# EAGLE design vader (EAGLE 7.4.0)
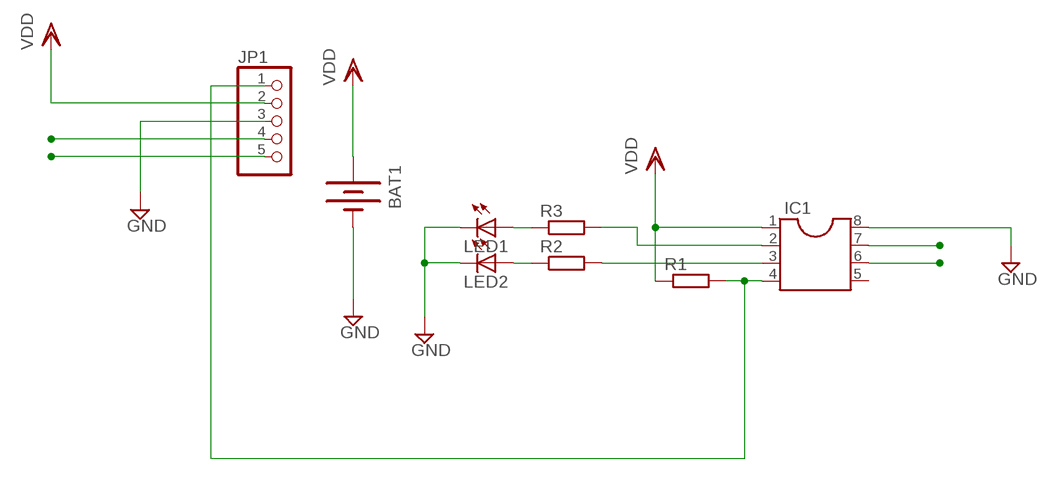
[diagram p0: schematic, sheet 1]

## Parts
BAT1  BATTERY20PTH  [BATTCOM_20MM_PTH]
IC1  DIL8S  [SOCKET-08]
JP1  PINHD-1X5  [1X05]
LED1  LED3MM  [LED3MM]
LED2  LED3MM  [LED3MM]
R1  R-EU_0204/7  [0204/7]
R2  R-EU_0204/7  [0204/7]
R3  R-EU_0204/7  [0204/7]

## Nets
GND: BAT1.2(-) IC1.8 JP1.3 LED1.K(C) LED2.K(C)
ICSPCLK: IC1.6 JP1.5
ICSPDAT: IC1.7 JP1.4
N$2: IC1.4 JP1.1 R1.2
N$3: IC1.3 R2.2
N$4: IC1.2 R3.2
N$5: LED1.A R3.1
N$6: LED2.A R2.1
VDD: BAT1.1(+) IC1.1 JP1.2 R1.1
Unconnected: IC1.5

## Library data of the parts
BAT1 = SparkFun-Electromechanical:BATTERY: Battery Holders Various common sizes : AA, AAA, 18650 (PRT-12895), 20mm coin cell and 12mm coin cell. 20MM_4LEGS, BATT-10373
IC1 = ic-package:DIL8: Dual In Line / Socket
JP1 = pinhead:PINHD-1X5: PIN HEADER
LED1 LED2 = led:LED: LED OSRAM: - CHIPLED LG R971, LG N971, LY N971, LG Q971, LY Q971, LO R971, LY R971 LH N974, LH R974 LS Q976, LO Q976, LY Q976 LO Q996 - Hyper CHIPLED LW Q18S LB Q993, LB Q99A, LB R99A - SideLED LS A670, LO A670, LY A670, LG A670, LP A670 LB A673, LV A673, LT A673, LW A673 LH A674 LY A675 LS A676, LA A676, LO A676, LY A676, LW A676 LS A679, LY A679, LG A679 - Hyper Micro SIDELED® LS Y876, LA Y876, LO Y876, LY Y876 LT Y87S - SmartLED LW L88C, LW L88S LB L89C, LB L89S, LG L890 LS L89K, LO L89K, LY L89K LS L896, LA L896, LO L896, LY L896 - TOPLED LS T670, LO T670, LY T670, LG T670, LP T670 LSG T670, LSP T670, LSY T670, LOP T670, LYG T670 LG T671, LOG T671, LSG T671 LB T673, LV T673, LT T673, LW T673 LH T674 LS T676, LA T676, LO T676, LY T676, LB T676, LH T676, LSB T676, LW T676 LB T67C, LV T67C, LT T67C, LS T67K, LO T67K, LY T67K, LW E67C LS E67B, LA E67B, LO E67B, LY E67B, LB E67C, LV E67C, LT E67C LW T67C LS T679, LY T679, LG T679 LS T770, LO T770, LY T770, LG T770, LP T770 LB T773, LV T773, LT T773, LW T773 LH T774 LS E675, LA E675, LY E675, LS T675 LS T776, LA T776, LO T776, LY T776, LB T776 LHGB T686 LT T68C, LB T68C - Hyper Mini TOPLED® LB M676 - Mini TOPLED Santana® LG M470 LS M47K, LO M47K, LY M47K Source: http://www.osram.convergy.de LUXEON: - LUMILED® LXK2-PW12-R00, LXK2-PW12-S00, LXK2-PW14-U00, LXK2-PW14-V00 LXK2-PM12-R00, LXK2-PM12-S00, LXK2-PM14-U00 LXK2-PE12-Q00, LXK2-PE12-R00, LXK2-PE12-S00, LXK2-PE14-T00, LXK2-PE14-U00 LXK2-PB12-K00, LXK2-PB12-L00, LXK2-PB12-M00, LXK2-PB14-N00, LXK2-PB14-P00, LXK2-PB14-Q00 LXK2-PR12-L00, LXK2-PR12-M00, LXK2-PR14-Q00, LXK2-PR14-R00 LXK2-PD12-Q00, LXK2-PD12-R00, LXK2-PD12-S00 LXK2-PH12-R00, LXK2-PH12-S00 LXK2-PL12-P00, LXK2-PL12-Q00, LXK2-PL12-R00 Source: www.luxeon.com KINGBRIGHT: KA-3528ASYC Source: www.kingbright.com
R1-R3 = resistor:R-EU_: RESISTOR, European symbol

## Board
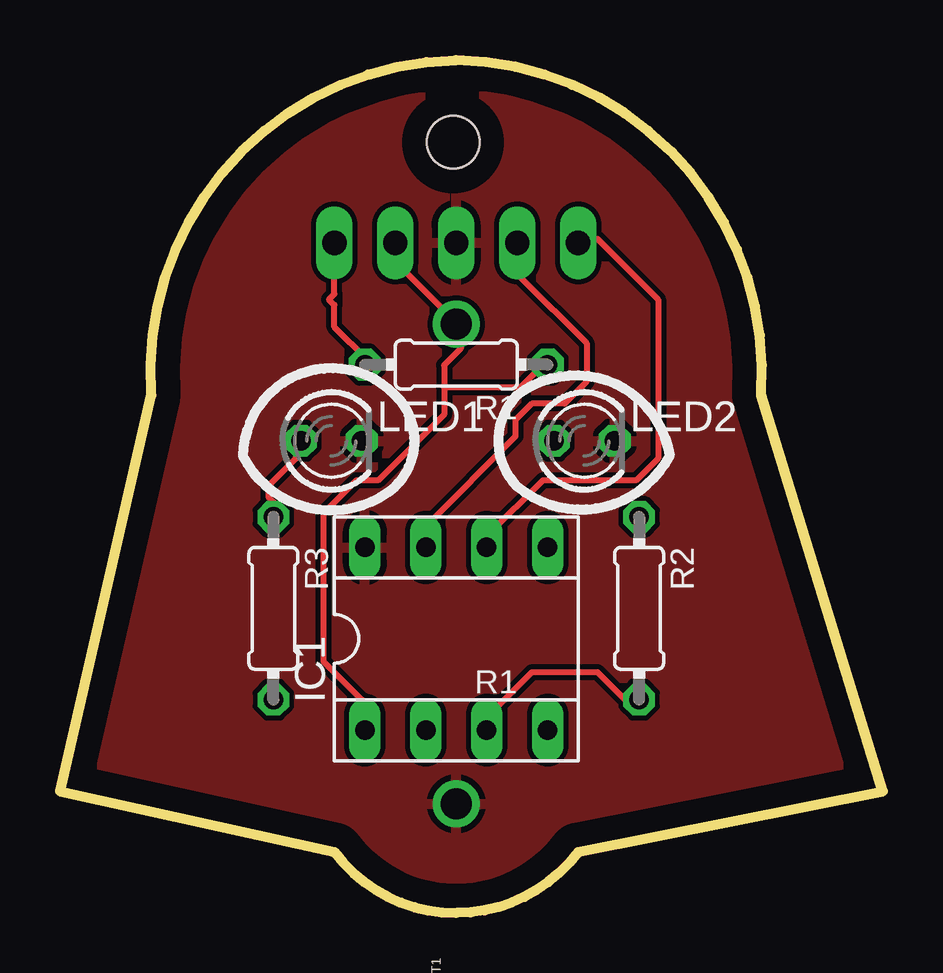
[diagram p1: board, top side]
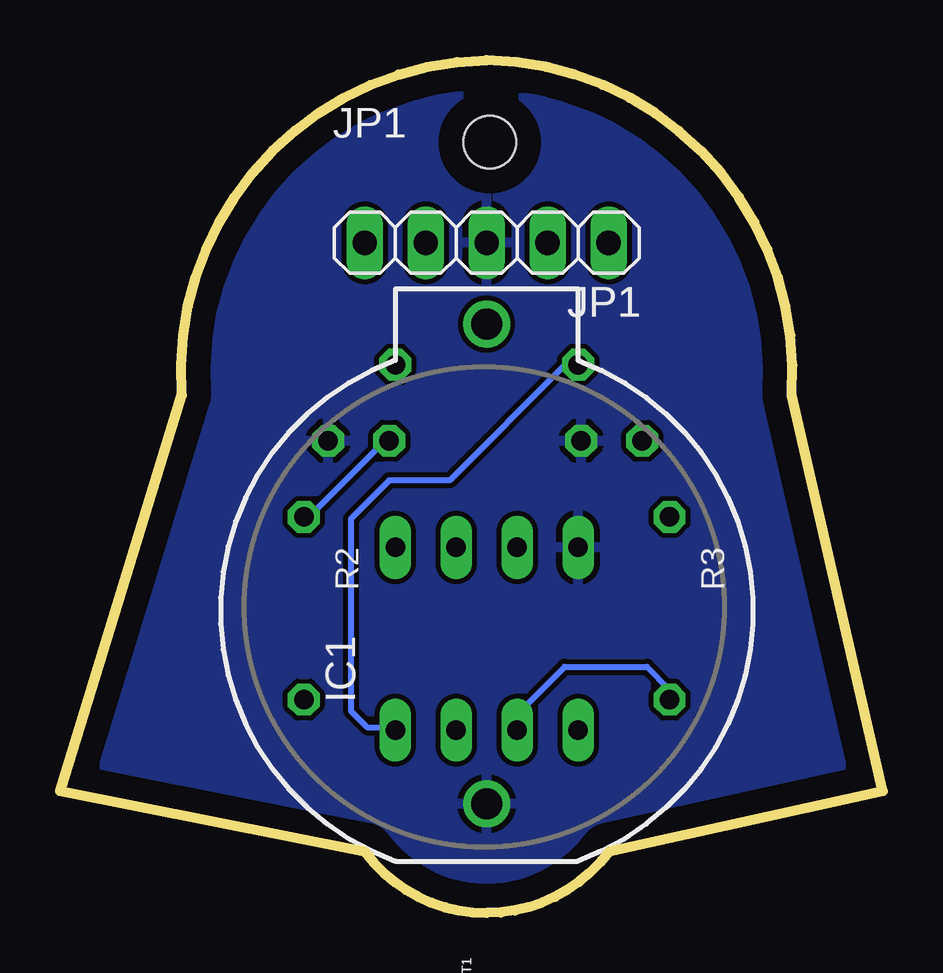
[diagram p2: board, bottom side, seen from below]

Size 34.29 x 35.56 mm. Coordinates in mm from the lower left corner, seen from the top.
Outline: 0,5.08 11.43,2.54 arc53 16.51,0 arc53 21.59,2.54 34.29,5.08 29.21,21.59 arc93 16.51,35.56 arc93 3.81,21.59 0,5.08
Copper layers (1*16): Top 0.035mm / dielectric 1.5mm / Bottom 0.035mm
Design rules "default": minimum track width 10mil, minimum drill 24mil, track to track 8mil, track to pad 8mil, pad to pad 8mil, via to via 8mil, smd to smd 8mil, copper to edge 40mil, drill to drill 8mil, minimum pad ring 10mil, minimum via ring 8mil, stop-mask expansion 4mil, vias tented up to drill 0mil, thermal gap 10mil
Holes 2.2 mm at 16.38,32.13

### Footprints (pad centres in the part's own frame; a part is rotated, then mirrored left to right if it is on the bottom)
BATTCOM_20MM_PTH = drill 1.3: 1 11.85,0; 2 -8.15,0
SOCKET-08 = drill 0.813 long: 1 -3.81,-3.81; 2 -1.27,-3.81; 3 1.27,-3.81; 4 3.81,-3.81; 5 3.81,3.81; 6 1.27,3.81; 7 -1.27,3.81; 8 -3.81,3.81
1X05 = drill 1.016 long: 1 -5.08,0; 2 -2.54,0; 3 0,0; 4 2.54,0; 5 5.08,0
LED3MM = drill 0.813 octagon: A -1.27,0; K 1.27,0
0204/7 = drill 0.813 octagon: 1 -3.81,0; 2 3.81,0

### Placement (x,y rotation side)
BAT1  16.51,12.7 90 bottom
IC1  16.51,11.43 0 top
JP1  16.51,27.94 180 bottom
LED1  11.3,19.69 0 top
LED2  21.84,19.69 0 top
R1  16.51,22.86 180 top
R2  24.13,12.7 270 top
R3  8.89,12.7 270 top

### Tracks (layer width: path | path; a pad name or v marks a point on that pad's centre or on a via)
GND
  pour Top: -1.27,-1.27 35.56,-1.27 35.56,36.83 -1.27,36.83
  pour Bottom: -1.27,-1.27 35.56,-1.27 35.56,36.83 -1.27,36.83
ICSPCLK
  Top 0.254: IC1.6 17.83,15.29 17.83,15.75 20.12,18.03 24,18.03 24.92,18.95 24.92,25.58 22.4,28.09 21.72,28.09 JP1.5
ICSPDAT
  Top 0.254: IC1.7 15.32,15.29 15.32,16.21 18.97,19.86 18.97,20.55 19.66,21.23 21.03,21.23 21.95,22.15 21.95,23.75 19.2,26.49 19.2,27.86 JP1.4
N$2
  Top 0.254: JP1.1 11.43,25.81 11.2,25.58 11.43,25.35 11.43,24.44 12.8,23.06 R1.2
  Bottom 0.254: IC1.4 20.34,7.75 21.49,7.75 22.17,8.43 22.17,16.43 20.57,18.03 18.06,18.03 13.26,22.84 12.8,22.84 R1.2
N$3
  Top 0.254: R2.2 23.55,8.89 22.4,10.03 19.66,10.03 17.83,8.2 17.83,7.75 IC1.3
N$4
  Bottom 0.254: R3.2 8.91,8.89 8.91,9.35 9.83,10.26 13.26,10.26 15.09,8.43 15.09,7.75 IC1.2
N$5
  Top 0.254: R3.1 8.91,16.66 8.91,17.12 8.69,17.35 8.69,17.8 9.83,18.95 9.83,19.63 LED1.A
N$6
  Bottom 0.254: R2.1 24,16.66 23.77,16.66 20.57,19.86 LED2.A
VDD
  Top 0.254: 16,21.92 16,22.84 16.69,23.52 16.69,24.44 BAT1.1 16.46,24.66 14.17,26.95 14.17,27.86 JP1.2 | 16,21.92 16,20.78 13.26,18.03 12.34,18.03 10.97,16.66 10.97,10.49 12.57,8.89 12.57,7.75 IC1.1 | 16,21.92 19.2,21.92 20.12,22.84 R1.1

### Text on the board
_tNames: R1 | LED1 | LED1 | LED2 | LED2 | R3 | R2 | R1 | IC1 | BAT1
_bNames: JP1 | JP1 | R3 | R2 | IC1 | BAT1